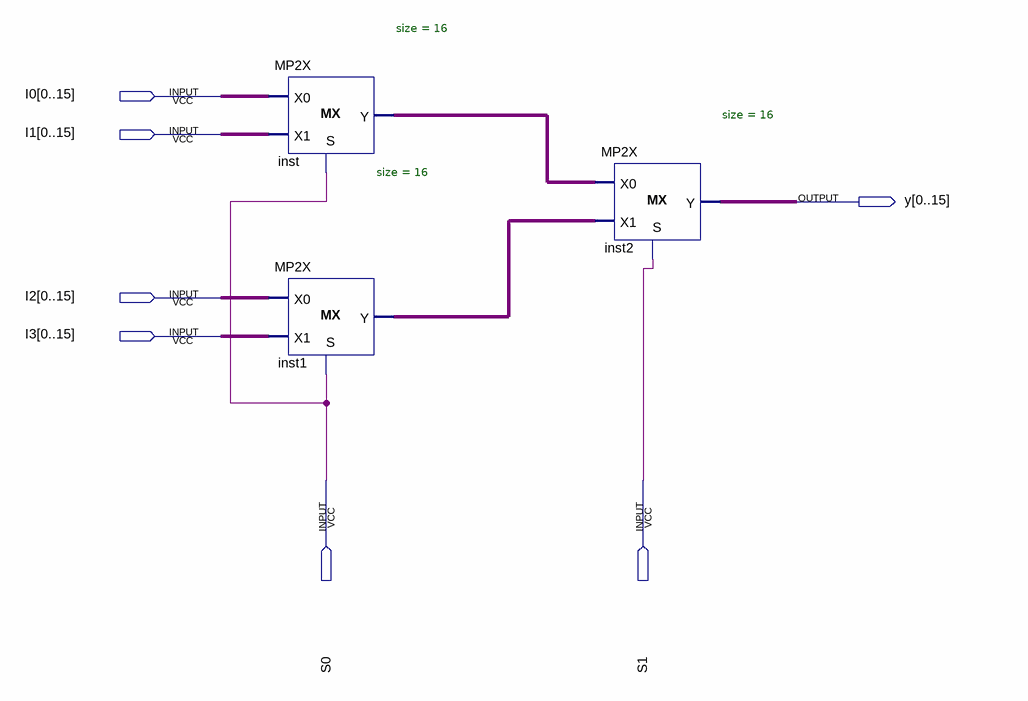
[diagram p0: schematic sheet]
// Quartus schematic MP4-1.bdf as structural Verilog: 3 symbols, 7 pins
module \MP4-1  (
  input  [0:15] I0,
  input  [0:15] I1,
  input  [0:15] I2,
  input  [0:15] I3,
  input  S0,
  input  S1,
  output [0:15] y
);

  wire [15:0] inst1_y, inst_y;

  MP2X #(.size(16)) inst (.S(S0), .X0(I0), .X1(I1), .Y(inst_y));
  MP2X #(.size(16)) inst1 (.S(S0), .X0(I2), .X1(I3), .Y(inst1_y));
  MP2X #(.size(16)) inst2 (.S(S1), .X0(inst_y), .X1(inst1_y), .Y(y));
endmodule
